# Altium schematic sheet MCU_Connections.SchDoc: STM32L4 Connections
size Letter; DrawnBy: Zach Haviland; DocumentNumber: 1; Revision: 1.0; SheetNumber: 1; SheetTotal: 4
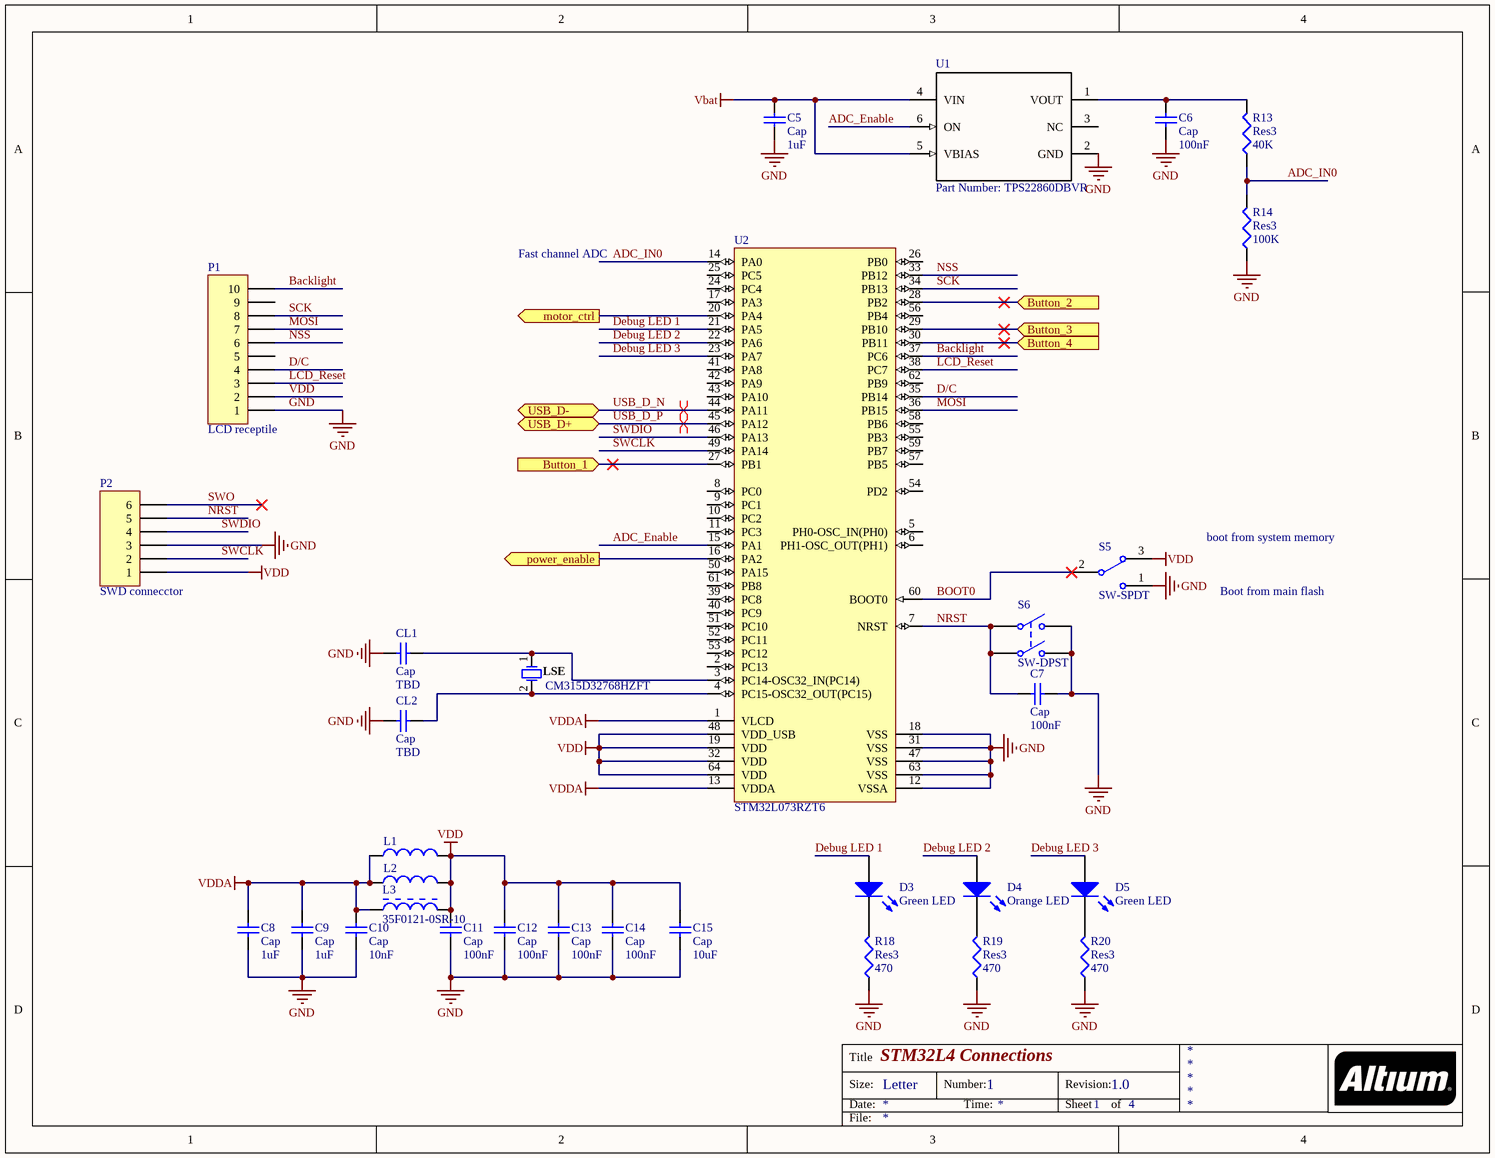
[diagram p0: MCU_Connections.SchDoc]

## Parts
C5  Cap  value 1uF  [C0805]
C6  Cap  value 100nF  [C0805]
C7  Cap  value 100nF  [C0805]
C8  Cap  value 1uF  [C0805]
C9  Cap  value 1uF  [C0805]
C10  Cap  value 10nF  [C0805]
C11  Cap  value 100nF  [C0805]
C12  Cap  value 100nF  [C0805]
C13  Cap  value 100nF  [C0805]
C14  Cap  value 100nF  [C0805]
C15  Cap  value 10uF  [C0805]
CL1  Cap  value TBD  [C0805]
CL2  Cap  value TBD  [C0805]
D3  Green LED  [3.2X1.6X1.1]
D4  Orange LED  [3.2X1.6X1.1]
D5  Green LED  [3.2X1.6X1.1]
L1  (no value)  [C0805]
L2  (no value)  [C1206]
L3  35F0121-0SR-10  [LIRD-35F0121-0SR-10_V]
LSE  CM315D32768HZFT  [CMHT-CM315D-2_V]
P1  LCD receptile  [HDR1X10]
P2  SWD connecctor  [HDR1X6]
R13  Res3  value 40K  [1608[0603]]
R14  Res3  value 100K  [1608[0603]]
R18  Res3  value 470  [1608[0603]]
R19  Res3  value 470  [1608[0603]]
R20  Res3  value 470  [1608[0603]]
S5  SW-SPDT  [HDR1X3]
S6  SW-DPST  [PCBComponent_1]
U1  Part Number: TPS22860DBVR  [DBV0006A_N]
U2  STM32L073RZT6  [STM-LQFP64_M]

## Ports
Button_1 (in), Button_2 (in), Button_3 (in), Button_4 (in), motor_ctrl (out), power_enable (out), USB_D+ (bidir), USB_D- (bidir)

## Nets
GND: C5.1 C6.1 C7.2 C8.1 C9.1 C10.1 C11.1 C12.1 C13.1 C14.1 C15.1 CL1.1 CL2.1 P1.1 P2.3 R14.1 R18.1 R19.1 R20.1 S5.1 S6.2(NO1) S6.4(NO2) U1.2(GND) U2.12(VSSA) U2.18(VSS) U2.31(VSS) U2.47(VSS) U2.63(VSS)
Vbat: C5.2 U1.4(VIN) U1.5(VBIAS)
VDD: C11.2 C12.2 C13.2 C14.2 C15.2 L1.2 L2.2 L3.2 P1.2 P2.1 S5.3 U2.19(VDD) U2.32(VDD) U2.48(VDD_USB) U2.64(VDD)
VDDA: C8.2 C9.2 C10.2 L1.1 L2.1 L3.1 U2.1(VLCD) U2.13(VDDA)
ADC_Enable: U1.6(ON) U2.15(PA1)
ADC_IN0: R13.1 R14.2 U2.14(PA0)
Backlight: P1.10 U2.37(PC6)
BOOT0: S5.2 U2.60(BOOT0)
Button_1: U2.27(PB1) ; port Button_1
Button_2: U2.28(PB2) ; port Button_2
Button_3: U2.29(PB10) ; port Button_3
Button_4: U2.30(PB11) ; port Button_4
D/C: P1.4 U2.35(PB14)
Debug LED 1: D3.1(A) U2.21(PA5)
Debug LED 2: D4.1(A) U2.22(PA6)
Debug LED 3: D5.1(A) U2.23(PA7)
LCD_Reset: P1.3 U2.38(PC7)
MOSI: P1.7 U2.36(PB15)
motor_ctrl: U2.20(PA4) ; port motor_ctrl
NRST: C7.1 P2.5 S6.1(COMMON1) S6.3(COMMON2) U2.7(NRST)
NSS: P1.6 U2.33(PB12)
power_enable: U2.16(PA2) ; port power_enable
SCK: P1.8 U2.34(PB13)
SWCLK: P2.2 U2.49(PA14)
SWDIO: P2.4 U2.46(PA13)
SWO: P2.6
USB_D_N: U2.44(PA11) ; port USB_D-
USB_D_P: U2.45(PA12) ; port USB_D+
NetC6_2: C6.2 R13.2 U1.1(VOUT)
NetCL1_2: CL1.2 LSE.1 U2.3(PC14-OSC32_IN(PC14))
NetCL2_2: CL2.2 LSE.2 U2.4(PC15-OSC32_OUT(PC15))
NetD3_2: D3.2(K) R18.2
NetD4_2: D4.2(K) R19.2
NetD5_2: D5.2(K) R20.2

Not connected (* = marked no-connect by the designer): P1 5 9; U1 3(NC); U2 2(PC13) 5(PH0-OSC_IN(PH0)) 6(PH1-OSC_OUT(PH1)) 8(PC0) 9(PC1) 10(PC2) 11(PC3) 17(PA3) 24(PC4) 25(PC5) 26(PB0) 39(PC8) 40(PC9) 41(PA8) 42(PA9) 43(PA10) 50(PA15) 51(PC10) 52(PC11) 53(PC12) 54(PD2) 55(PB3) 56(PB4) 57(PB5) 58(PB6) 59(PB7) 61(PB8) 62(PB9)

## Layout directives
differential pair: USB_D_N, USB_D_P

## Notes on the sheet
- Fast channel ADC
- boot from system memory
- Boot from main flash
- Caps dependant on board capacitance. Apprxomate range 21pF to 11pF. Refer to page 29 of notebook for calculation
- looking for explanation on caps for VDDA.
  following bypass cap convention (smallest cap near device)? if true, should fix schematic
- Title
- Size:
- Date:
- Letter
- Number:
- Time:
- Revision:
- Sheet
- of
- File:

## Library data of the parts
C5-C15 CL1 CL2 = Cap: Capacitor; Published: 8-Jun-2000; LatestRevisionDate: 17-Jul-2002; LatestRevisionNote: Re-released for DXP Platform.; PackageReference: RAD-0.3; Publisher: Altium Limited; PackageDescription: Radial Cap, Thru-Hole; 2 Leads; 0.3 in Pin Spacing
D3-D5 = LED2: Typical RED, GREEN, YELLOW, AMBER GaAs LED; Published: 8-Jun-2000; LatestRevisionDate: 17-Jul-2002; LatestRevisionNote: Re-released for DXP Platform.; PackageVersion: Feb-2002; PackageReference: 3.2X1.6X1.1; Publisher: Altium Limited; PackageDescription: SM LED; 2 Flat Leads
L1 L2 = Inductor: Code_IEC: 1005; Published: 8-Jun-2000; LatestRevisionDate: 29-May-2009; LatestRevisionNote: IPC-7351 Footprint Added.; PackageReference: 0402-A; Publisher: Altium Limited; PackageDescription: Chip Inductor; Code_JEITA: 0402
L3 = CMP-2000-05596-1: EMI Filtering & RF Inductor, 10 A, 0.75 mOhm, -40 to 125 degC, 2-Pin SMD, RoHS, Tape and Reel; Manufacturer: Laird; Online Catalog: ChipBeads-PowerFiltering; Kits: 240-2227-ND-KITEMIFERRITEBEADCHIPSMD; Catalog Drawings: (28,35)F0121-0SR-10; Other Names: 240-2520-1; Number of Lines: 1; Filter Type: PowerLine; Impedance @ Frequency: 41Ohm@100MHz; Current Rating (Max): 10A; Datasheet URL: https://assets.lairdtech.com/home/brandworld/files/35F0121-0SR-10.pdf; Category: Filters; Packaging: CutTape(CT); Operating Temperature: -40°C~125°C; Family: FerriteBeadsandChips; Series: 35; Ratings: -; Package Description: 2-Pin Surface Mount Device, Body 4.06 x 3.05 mm; Datasheet Version: Rev. F, 04/2015; Mounting Technology: SurfaceMount; Package URL: http://cdn.lairdtech.com/home/brandworld/files/35F0121-0SR-10.pdf; Package Reference: 35F0121-0SR-10; DC Resistance (DCR) (Max): 0.75mOhm; Manufacturer URL: https://www.lairdtech.com/; Standard Package: 1; Package / Case: 2-SMD,J-Lead; Mounting Type: SurfaceMount
LSE = CMP-2000-05089-1: Turning Fork Crystal Unit, 32.768 KHz, -40 to 85 degC, 2-Pin SMD, RoHS, Tape and Reel. Note: Part from altium library is a DZFT, renamed to HZFT to reflect part that's actually going to be used; Manufacturer: Citizen Micro HumanTech; Package Version: Rev. 1.4, 09/2012; Package Reference: CM315D-2; Package Description: 2-Pin Surface Mount Device, Body 1.6 x 3.3 mm, Pitch 2.5 mm; Package URL: http://cfm.citizen.co.jp/english/product/pdf/CM315D.pdf; Manufacturer URL: http://www.citizen-systems.com/us/start; Datasheet Version: Rev. 1.4, 09/2012; Datasheet URL: http://cfm.citizen.co.jp/english/product/pdf/CM315D.pdf
P1 = Header 10: Header, 10-Pin; LatestRevisionDate: 17-Jul-2002; LatestRevisionNote: Re-released for DXP Platform.; Publisher: Altium Limited
P2 = Header 6: Header, 6-Pin; LatestRevisionDate: 17-Jul-2002; LatestRevisionNote: Re-released for DXP Platform.; Publisher: Altium Limited
R13 R14 R18-R20 = Res3: Resistor; Published: 8-Jun-2000; LatestRevisionDate: 29-May-2009; LatestRevisionNote: IPC-7351 Footprint Added.; PackageReference: J1-0603; Publisher: Altium Limited; PackageDescription: Chip Resistor
S5 = SW-SPDT: SPDT Subminiature Toggle Switch, Right Angle Mounting, Vertical Actuation; Published: 24-Mar-1999; LatestRevisionDate: 17-Dec-2003; LatestRevisionNote: Schematic revised, PCB Footprint replaced.; DatasheetVersion: 05-Dec-2000; PackageReference: TL36WW15050; Publisher: Altium Limited; PackageDescription: Switch; 4 Leads; ComponentLink1Description: Manufacturer Link; ComponentLink1URL: http://www.apem.com
S6 = SW-DPST: Double-Pole, Single-Throw Switch; Published: 24-Mar-1999; LatestRevisionDate: 17-Jul-2002; LatestRevisionNote: Re-released for DXP Platform.; PackageReference: DPST-4; Publisher: Altium Limited; PackageDescription: Switch; 4 Leads
U1 = TPS22860DBVR: No Description Available; Vendor: Texas Instruments; Built_By: Texas_Instrument_Team; CompType: IC; Manufacturer_Part_Number: TPS22860DBVR; Copyright: Copyright (C) 2018 Accelerated Designs. All rights reserved; RefDes: RefDes; Type: DEV; Value: Value; Application_BuildNumber: *; PartNumber: TPS22860DBVR; PackageReference: DBV0006A; MountType: SMT; RoHS: Y; Manufacturer: Texas Instruments
U2 = CMP-1546-00073-1: Ultra-Low-Power ARM Cortex-M0+ MCU, 192 KB Flash, 20 KB Internal RAM, 51 I/Os, 64-Pin LQFP, -40 to 85 degC, Tray; Internal RAM Size (kB): 20; Data E2PROM nom (B): 6144; FLASH Size (Prog) (kB): 192; Operating Frequency(F) (Processor speed) (MHz): 32; D/A Converter: 2; I/Os (High Current): 51; Supply Voltage(Vcc) min (V): 1.8; ComponentLink1Description: Manufacturer URL; ComponentLink2Description: Datasheet; DatasheetVersion: Rev. 2; Mounting Technology: Surface Mount; Package Description: 64-Pin Low-profile Quad Flat Package, Body 10 x 10 mm, Pitch 0.5 mm; ComponentLink2URL: http://www.st.com/st-web-ui/static/active/en/resource/technical/document/datasheet/DM00141036.pdf; Core: ARM Cortex-M0+; Packing: Tray; ComponentLink1URL: http://www.st.com/; Package Reference: LQFP64